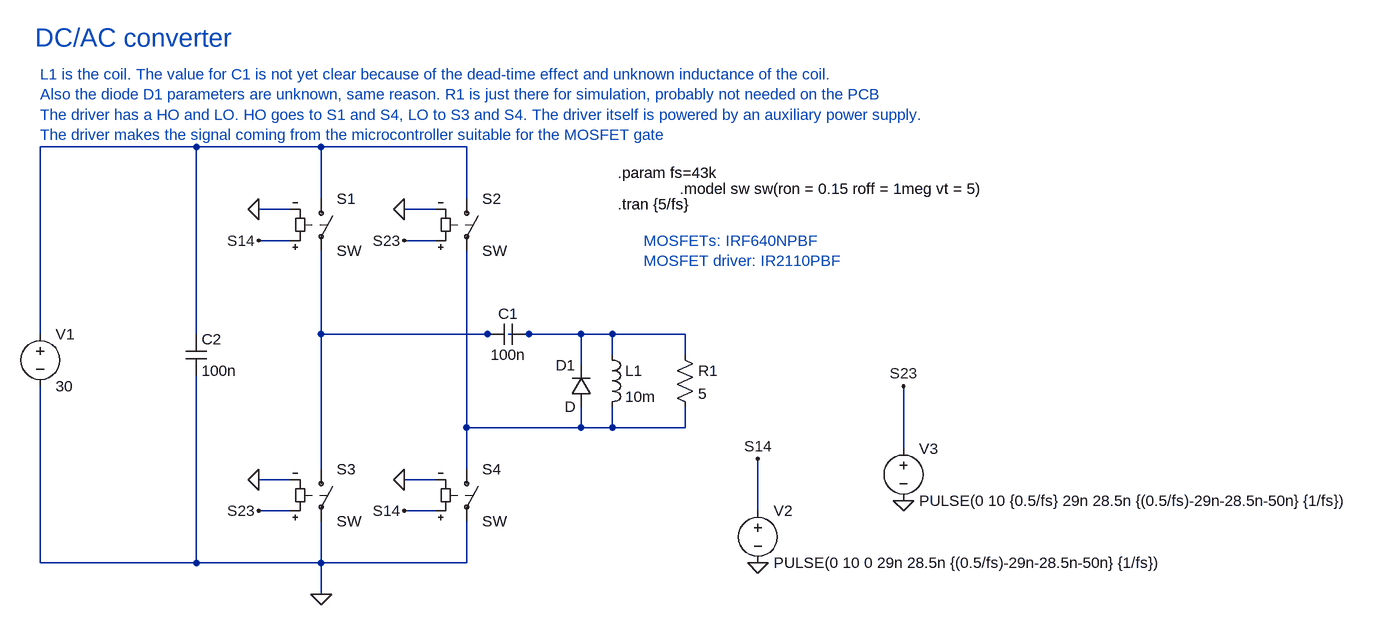
[diagram p0: schematic Full bridge inverter.asc]
Full bridge inverter.asc, the LTspice schematic file:
Version 4
SHEET 1 2360 680
WIRE 128 -112 -112 -112
WIRE 320 -112 128 -112
WIRE 544 -112 320 -112
WIRE 320 -32 320 -112
WIRE 544 -32 544 -112
WIRE 272 -16 224 -16
WIRE 496 -16 448 -16
WIRE 272 32 224 32
WIRE 496 32 448 32
WIRE -112 176 -112 -112
WIRE 128 176 128 -112
WIRE 320 176 320 48
WIRE 576 176 320 176
WIRE 592 176 576 176
WIRE 640 176 608 176
WIRE 720 176 640 176
WIRE 768 176 720 176
WIRE 880 176 768 176
WIRE 768 208 768 176
WIRE 880 208 880 176
WIRE 720 224 720 176
WIRE 544 320 544 48
WIRE 720 320 720 288
WIRE 720 320 544 320
WIRE 768 320 768 288
WIRE 768 320 720 320
WIRE 880 320 880 288
WIRE 880 320 768 320
WIRE 1216 352 1216 256
WIRE 320 384 320 176
WIRE 544 384 544 320
WIRE 272 400 224 400
WIRE 496 400 448 400
WIRE 272 448 224 448
WIRE 496 448 448 448
WIRE 992 448 992 368
WIRE -112 528 -112 256
WIRE 128 528 128 240
WIRE 128 528 -112 528
WIRE 320 528 320 464
WIRE 320 528 128 528
WIRE 544 528 544 464
WIRE 544 528 320 528
WIRE 320 576 320 528
FLAG 320 576 0
FLAG 224 -16 0
FLAG 448 -16 0
FLAG 448 400 0
FLAG 224 400 0
FLAG 224 448 S23
FLAG 448 32 S23
FLAG 448 448 S14
FLAG 224 32 S14
FLAG 992 528 0
FLAG 1216 432 0
FLAG 992 368 S14
FLAG 1216 256 S23
SYMBOL voltage -112 160 R0
WINDOW 123 0 0 Left 0
WINDOW 39 0 0 Left 0
SYMATTR InstName V1
SYMATTR Value 30
SYMBOL sw 544 -48 R0
SYMATTR InstName S2
SYMBOL sw 544 368 R0
SYMATTR InstName S4
SYMBOL sw 320 -48 R0
SYMATTR InstName S1
SYMBOL sw 320 368 R0
SYMATTR InstName S3
SYMBOL cap 112 176 R0
SYMATTR InstName C2
SYMATTR Value 100n
SYMBOL voltage 992 432 R0
WINDOW 123 0 0 Left 0
WINDOW 39 0 0 Left 0
SYMATTR InstName V2
SYMATTR Value PULSE(0 10 0 29n 28.5n {(0.5/fs)-29n-28.5n-50n} {1/fs})
SYMBOL voltage 1216 336 R0
WINDOW 123 0 0 Left 0
WINDOW 39 0 0 Left 0
SYMATTR InstName V3
SYMATTR Value PULSE(0 10 {0.5/fs} 29n 28.5n {(0.5/fs)-29n-28.5n-50n} {1/fs})
SYMBOL cap 576 192 R270
WINDOW 0 32 32 VTop 2
WINDOW 3 0 32 VBottom 2
SYMATTR InstName C1
SYMATTR Value 100n
SYMBOL ind 752 192 R0
SYMATTR InstName L1
SYMATTR Value 10m
SYMBOL diode 736 288 R180
WINDOW 0 24 64 Left 2
WINDOW 3 24 0 Left 2
SYMATTR InstName D1
SYMBOL res 864 192 R0
SYMATTR InstName R1
SYMATTR Value 5
TEXT 776 -72 Left 2 !.param fs=43k
TEXT 872 -48 Left 2 !.model sw sw(ron = 0.15 roff = 1meg vt = 5)
TEXT 776 -24 Left 2 !.tran {5/fs}
TEXT 816 32 Left 2 ;MOSFETs: IRF640NPBF\nMOSFET driver: IR2110PBF
TEXT -112 -224 Left 2 ;L1 is the coil. The value for C1 is not yet clear because of the dead-time effect and unknown inductance of the coil.\nAlso the diode D1 parameters are unknown, same reason. R1 is just there for simulation, probably not needed on the PCB\nThe driver has a HO and LO. HO goes to S1 and S4, LO to S3 and S4. The driver itself is powered by an auxiliary power supply.\nThe driver makes the signal coming from the microcontroller suitable for the MOSFET gate
TEXT -120 -280 Left 4 ;DC/AC converter

The netlist it stands for:
* Full bridge inverter.asc
V1 N001 0 30
S2 N001 N004 S23 0 SW
S4 N004 0 S14 0 SW
S1 N001 N002 S14 0 SW
S3 N002 0 S23 0 SW
C2 N001 0 100n
V2 S14 0 PULSE(0 10 0 29n 28.5n {(0.5/fs)-29n-28.5n-50n} {1/fs})
V3 S23 0 PULSE(0 10 {0.5/fs} 29n 28.5n {(0.5/fs)-29n-28.5n-50n} {1/fs})
C1 N002 N003 100n
L1 N003 N004 10m
D1 N004 N003 D
R1 N003 N004 5
.model D D
.lib standard.dio
.param fs=43k
.model sw sw(ron = 0.15 roff = 1meg vt = 5)
.tran {5/fs}
* MOSFETs: IRF640NPBF
* MOSFET driver: IR2110PBF
* L1 is the coil. The value for C1 is not yet clear because of the dead-time effect and unknown inductance of the coil.
* Also the diode D1 parameters are unknown, same reason. R1 is just there for simulation, probably not needed on the PCB
* The driver has a HO and LO. HO goes to S1 and S4, LO to S3 and S4. The driver itself is powered by an auxiliary power supply.
* The driver makes the signal coming from the microcontroller suitable for the MOSFET gate
* DC/AC converter
.backanno
.end